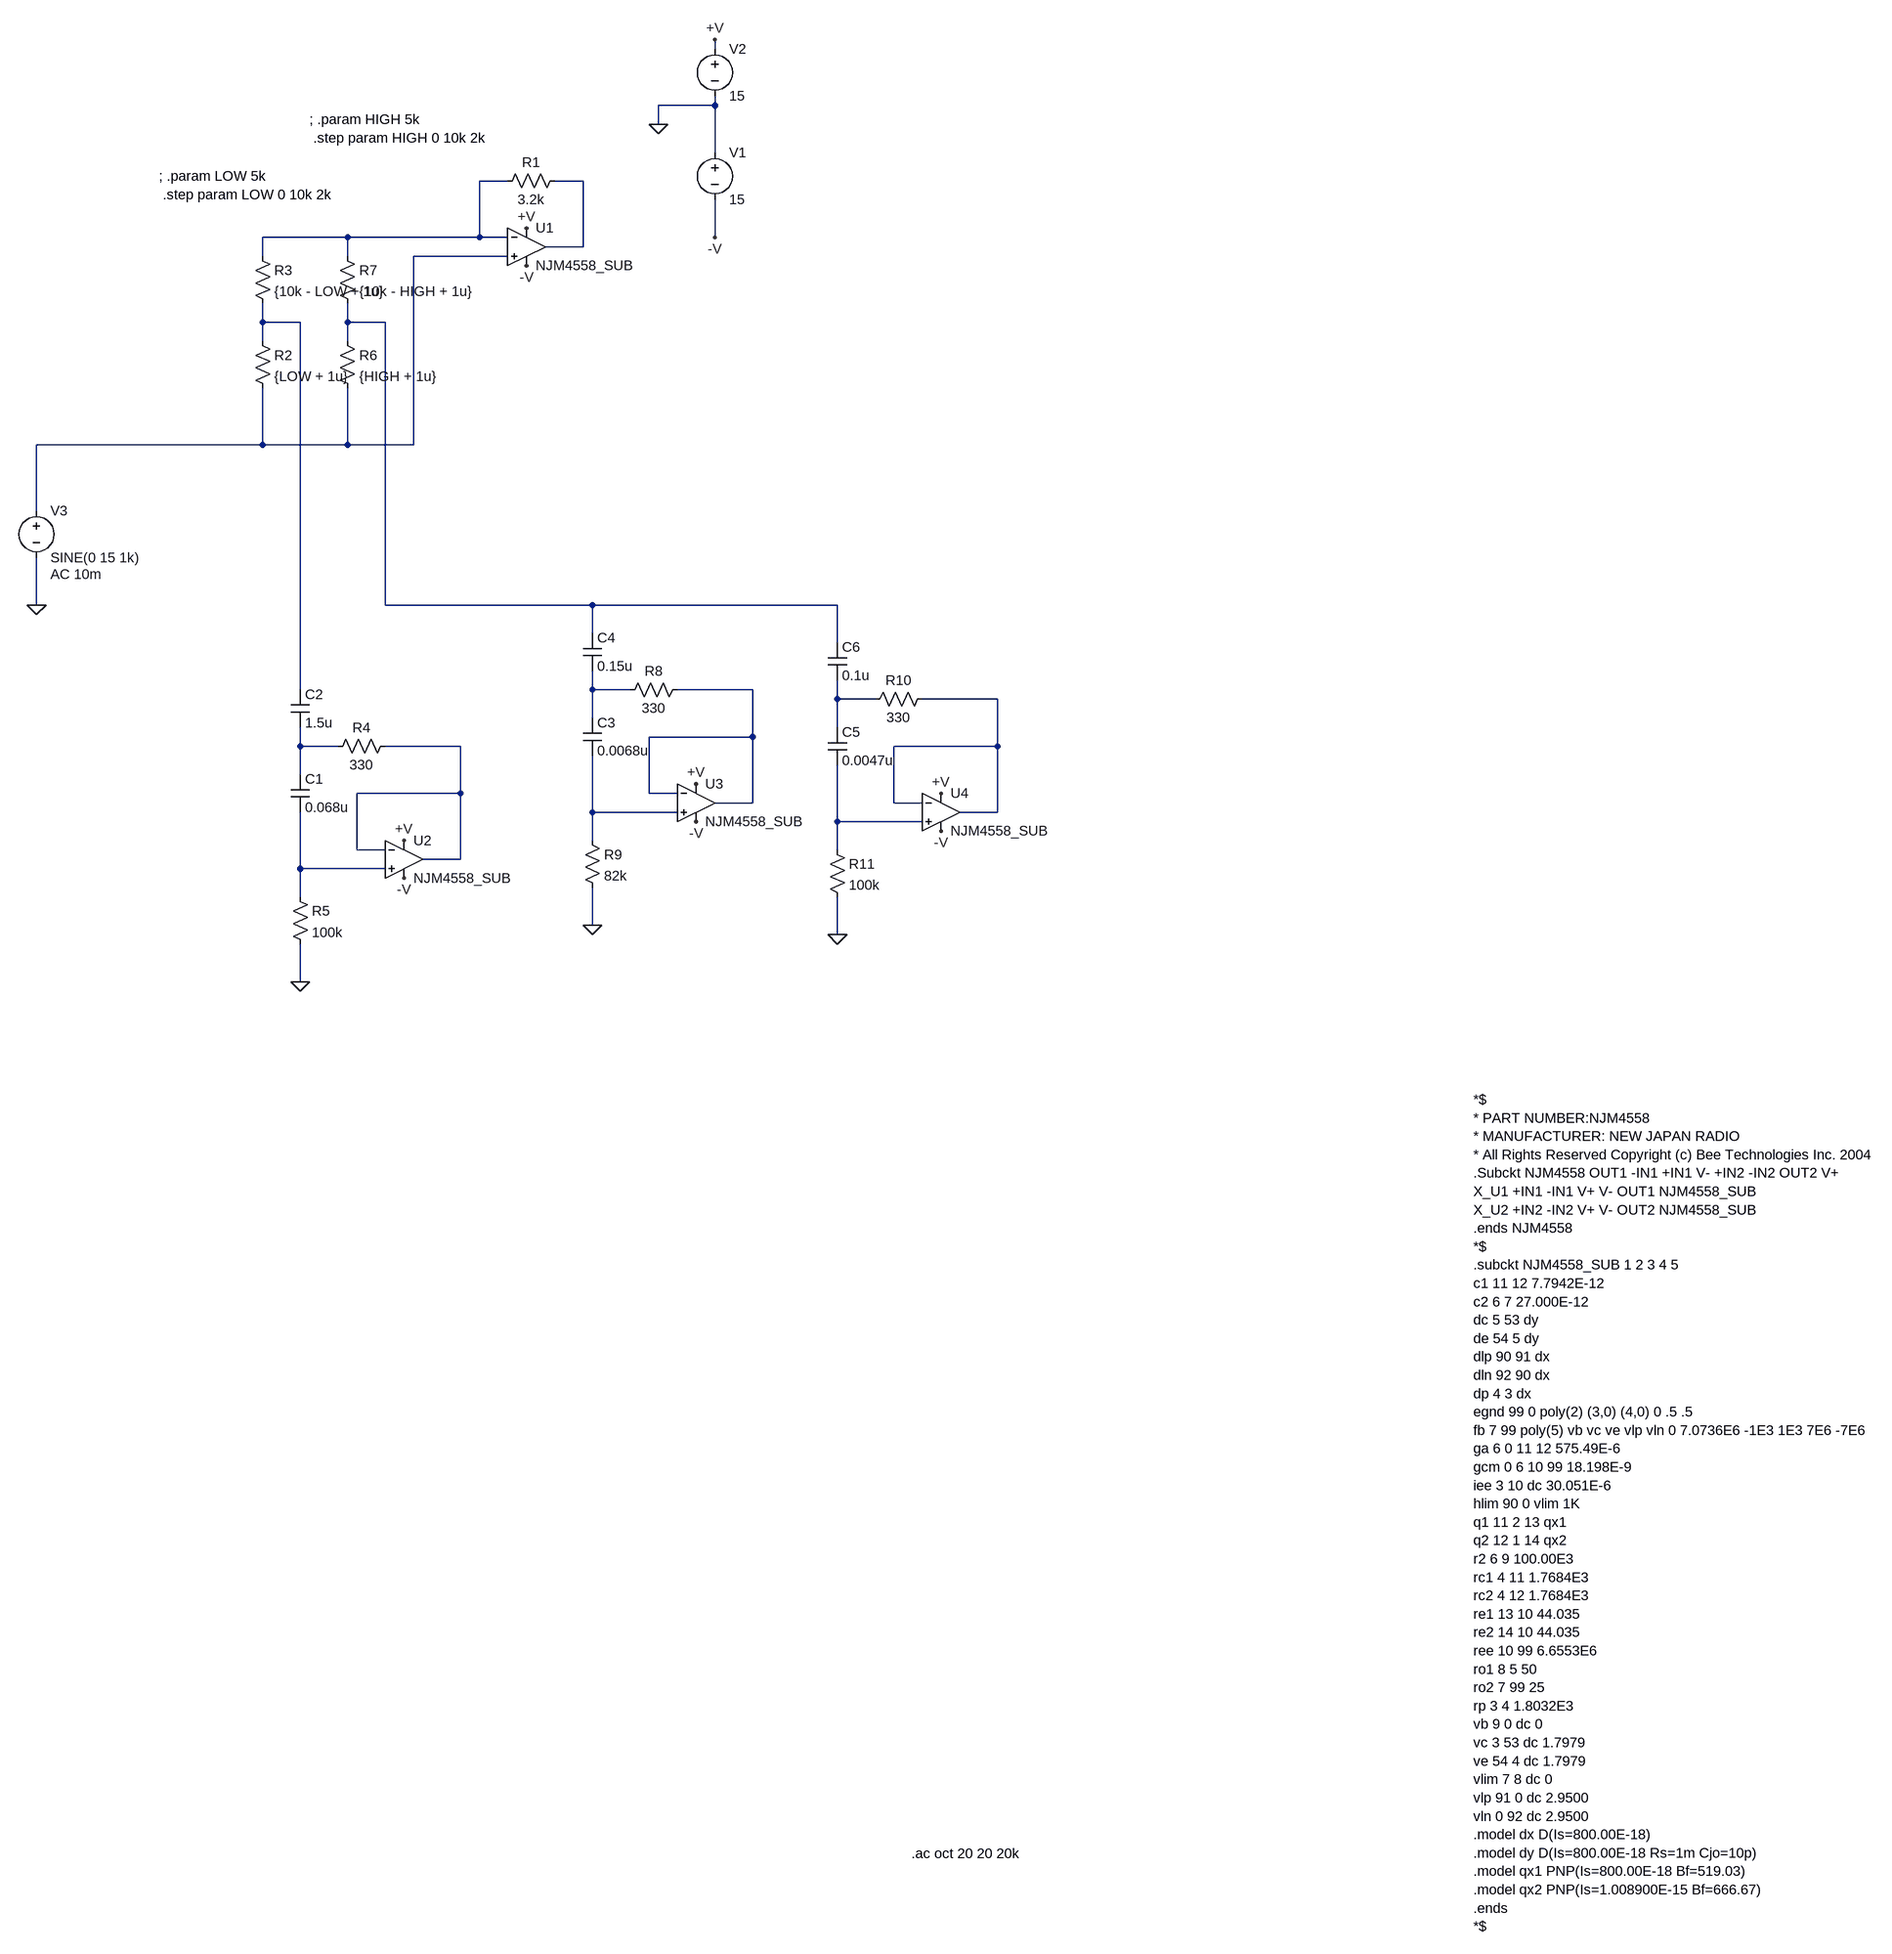
[diagram p0: schematic HM-2_tone.asc]
HM-2_tone.asc, the LTspice schematic file:
Version 4
SHEET 1 1024 2584
WIRE -1168 -496 -1168 -512
WIRE -1168 -400 -1168 -416
WIRE -1168 -400 -1264 -400
WIRE -1264 -368 -1264 -400
WIRE -1168 -320 -1168 -400
WIRE -1520 -272 -1568 -272
WIRE -1392 -272 -1440 -272
WIRE -1792 -176 -1936 -176
WIRE -1568 -176 -1568 -272
WIRE -1568 -176 -1792 -176
WIRE -1520 -176 -1568 -176
WIRE -1168 -176 -1168 -240
WIRE -1392 -160 -1392 -272
WIRE -1392 -160 -1456 -160
WIRE -1936 -144 -1936 -176
WIRE -1792 -144 -1792 -176
WIRE -1520 -144 -1680 -144
WIRE -1936 -32 -1936 -64
WIRE -1872 -32 -1936 -32
WIRE -1792 -32 -1792 -64
WIRE -1728 -32 -1792 -32
WIRE -1936 0 -1936 -32
WIRE -1792 0 -1792 -32
WIRE -1936 176 -1936 80
WIRE -1936 176 -2320 176
WIRE -1792 176 -1792 80
WIRE -1792 176 -1936 176
WIRE -1680 176 -1680 -144
WIRE -1680 176 -1792 176
WIRE -2320 288 -2320 176
WIRE -2320 448 -2320 368
WIRE -1728 448 -1728 -32
WIRE -1376 448 -1728 448
WIRE -960 448 -1376 448
WIRE -1376 496 -1376 448
WIRE -960 512 -960 448
WIRE -1872 592 -1872 -32
WIRE -1376 592 -1376 560
WIRE -1312 592 -1376 592
WIRE -1104 592 -1232 592
WIRE -960 608 -960 576
WIRE -896 608 -960 608
WIRE -688 608 -816 608
WIRE -1376 640 -1376 592
WIRE -960 656 -960 608
WIRE -1104 672 -1104 592
WIRE -1104 672 -1280 672
WIRE -1872 688 -1872 656
WIRE -1808 688 -1872 688
WIRE -1600 688 -1728 688
WIRE -688 688 -688 608
WIRE -688 688 -864 688
WIRE -1872 736 -1872 688
WIRE -1600 768 -1600 688
WIRE -1600 768 -1776 768
WIRE -1280 768 -1280 672
WIRE -1232 768 -1280 768
WIRE -1104 784 -1104 672
WIRE -1104 784 -1168 784
WIRE -864 784 -864 688
WIRE -816 784 -864 784
WIRE -1376 800 -1376 704
WIRE -1232 800 -1376 800
WIRE -688 800 -688 688
WIRE -688 800 -752 800
WIRE -960 816 -960 720
WIRE -816 816 -960 816
WIRE -1376 848 -1376 800
WIRE -1776 864 -1776 768
WIRE -1728 864 -1776 864
WIRE -960 864 -960 816
WIRE -1600 880 -1600 768
WIRE -1600 880 -1664 880
WIRE -1872 896 -1872 800
WIRE -1728 896 -1872 896
WIRE -1872 944 -1872 896
WIRE -1376 992 -1376 928
WIRE -960 1008 -960 944
WIRE -1872 1088 -1872 1024
FLAG -2320 448 0
FLAG -1264 -368 0
FLAG -1168 -512 +V
FLAG -1488 -192 +V
FLAG -1488 -128 -V
FLAG -1168 -176 -V
FLAG -1696 848 +V
FLAG -1696 912 -V
FLAG -1872 1088 0
FLAG -1200 752 +V
FLAG -1200 816 -V
FLAG -1376 992 0
FLAG -784 768 +V
FLAG -784 832 -V
FLAG -960 1008 0
SYMBOL Opamps\\opamp2 -1488 -224 R0
SYMATTR InstName U1
SYMATTR Value NJM4558_SUB
SYMBOL voltage -1168 -336 R0
WINDOW 123 0 0 Left 2
WINDOW 39 0 0 Left 2
SYMATTR InstName V1
SYMATTR Value 15
SYMBOL voltage -1168 -512 R0
WINDOW 123 0 0 Left 2
WINDOW 39 0 0 Left 2
SYMATTR InstName V2
SYMATTR Value 15
SYMBOL voltage -2320 272 R0
WINDOW 123 24 124 Left 2
WINDOW 39 0 0 Left 2
SYMATTR Value2 AC 10m
SYMATTR InstName V3
SYMATTR Value SINE(0 15 1k)
SYMBOL res -1424 -288 R90
WINDOW 0 0 56 VBottom 2
WINDOW 3 32 56 VTop 2
SYMATTR InstName R1
SYMATTR Value 3.2k
SYMBOL res -1952 -16 R0
SYMATTR InstName R2
SYMATTR Value {LOW + 1u}
SYMBOL Opamps\\opamp2 -1696 816 R0
SYMATTR InstName U2
SYMATTR Value NJM4558_SUB
SYMBOL cap -1888 736 R0
SYMATTR InstName C1
SYMATTR Value 0.068u
SYMBOL cap -1888 592 R0
SYMATTR InstName C2
SYMATTR Value 1.5u
SYMBOL res -1712 672 R90
WINDOW 0 0 56 VBottom 2
WINDOW 3 32 56 VTop 2
SYMATTR InstName R4
SYMATTR Value 330
SYMBOL res -1888 928 R0
SYMATTR InstName R5
SYMATTR Value 100k
SYMBOL res -1952 -160 R0
SYMATTR InstName R3
SYMATTR Value {10k - LOW + 1u}
SYMBOL res -1808 -16 R0
SYMATTR InstName R6
SYMATTR Value {HIGH + 1u}
SYMBOL res -1808 -160 R0
SYMATTR InstName R7
SYMATTR Value {10k - HIGH + 1u}
SYMBOL Opamps\\opamp2 -1200 720 R0
SYMATTR InstName U3
SYMATTR Value NJM4558_SUB
SYMBOL cap -1392 640 R0
SYMATTR InstName C3
SYMATTR Value 0.0068u
SYMBOL cap -1392 496 R0
SYMATTR InstName C4
SYMATTR Value 0.15u
SYMBOL res -1216 576 R90
WINDOW 0 0 56 VBottom 2
WINDOW 3 32 56 VTop 2
SYMATTR InstName R8
SYMATTR Value 330
SYMBOL res -1392 832 R0
SYMATTR InstName R9
SYMATTR Value 82k
SYMBOL Opamps\\opamp2 -784 736 R0
SYMATTR InstName U4
SYMATTR Value NJM4558_SUB
SYMBOL cap -976 656 R0
SYMATTR InstName C5
SYMATTR Value 0.0047u
SYMBOL cap -976 512 R0
SYMATTR InstName C6
SYMATTR Value 0.1u
SYMBOL res -800 592 R90
WINDOW 0 0 56 VBottom 2
WINDOW 3 32 56 VTop 2
SYMATTR InstName R10
SYMATTR Value 330
SYMBOL res -976 848 R0
SYMATTR InstName R11
SYMATTR Value 100k
TEXT 120 1288 Left 2 !*$\n* PART NUMBER:NJM4558\n* MANUFACTURER: NEW JAPAN RADIO\n* All Rights Reserved Copyright (c) Bee Technologies Inc. 2004\n.Subckt NJM4558 OUT1 -IN1 +IN1 V- +IN2 -IN2 OUT2 V+\nX_U1 +IN1 -IN1 V+ V- OUT1 NJM4558_SUB\nX_U2 +IN2 -IN2 V+ V- OUT2 NJM4558_SUB\n.ends NJM4558\n*$\n.subckt NJM4558_SUB 1 2 3 4 5\nc1 11 12 7.7942E-12\nc2 6 7 27.000E-12\ndc 5 53 dy\nde 54 5 dy\ndlp 90 91 dx\ndln 92 90 dx\ndp 4 3 dx\negnd 99 0 poly(2) (3,0) (4,0) 0 .5 .5\nfb 7 99 poly(5) vb vc ve vlp vln 0 7.0736E6 -1E3 1E3 7E6 -7E6\nga 6 0 11 12 575.49E-6\ngcm 0 6 10 99 18.198E-9\niee 3 10 dc 30.051E-6\nhlim 90 0 vlim 1K\nq1 11 2 13 qx1\nq2 12 1 14 qx2\nr2 6 9 100.00E3\nrc1 4 11 1.7684E3\nrc2 4 12 1.7684E3\nre1 13 10 44.035\nre2 14 10 44.035\nree 10 99 6.6553E6\nro1 8 5 50\nro2 7 99 25\nrp 3 4 1.8032E3\nvb 9 0 dc 0\nvc 3 53 dc 1.7979\nve 54 4 dc 1.7979\nvlim 7 8 dc 0\nvlp 91 0 dc 2.9500\nvln 0 92 dc 2.9500\n.model dx D(Is=800.00E-18)\n.model dy D(Is=800.00E-18 Rs=1m Cjo=10p)\n.model qx1 PNP(Is=800.00E-18 Bf=519.03)\n.model qx2 PNP(Is=1.008900E-15 Bf=666.67)\n.ends\n*$
TEXT -834 2568 Left 2 !.ac oct 20 20 20k
TEXT -2112 -280 Left 2 !; .param LOW 5k\n .step param LOW 0 10k 2k
TEXT -1856 -376 Left 2 !; .param HIGH 5k\n .step param HIGH 0 10k 2k

The netlist it stands for:
* HM-2_tone.asc
XU1 N003 N001 +V -V N002 NJM4558_SUB  ; pins In+ In- V+ V- OUT
V1 0 -V 15
V2 +V 0 15
V3 N003 0 SINE(0 15 1k) AC 10m
R1 N002 N001 3.2k
R2 N004 N003 {LOW + 1u}
XU2 N014 N011 +V -V N011 NJM4558_SUB  ; pins In+ In- V+ V- OUT
C1 N010 N014 0.068u
C2 N004 N010 1.5u
R4 N011 N010 330
R5 N014 0 100k
R3 N001 N004 {10k - LOW + 1u}
R6 N005 N003 {HIGH + 1u}
R7 N001 N005 {10k - HIGH + 1u}
XU3 N012 N007 +V -V N007 NJM4558_SUB  ; pins In+ In- V+ V- OUT
C3 N006 N012 0.0068u
C4 N005 N006 0.15u
R8 N007 N006 330
R9 N012 0 82k
XU4 N013 N009 +V -V N009 NJM4558_SUB  ; pins In+ In- V+ V- OUT
C5 N008 N013 0.0047u
C6 N005 N008 0.1u
R10 N009 N008 330
R11 N013 0 100k
*$
* PART NUMBER:NJM4558
* MANUFACTURER: NEW JAPAN RADIO
* All Rights Reserved Copyright (c) Bee Technologies Inc. 2004
.Subckt NJM4558 OUT1 -IN1 +IN1 V- +IN2 -IN2 OUT2 V+
X_U1 +IN1 -IN1 V+ V- OUT1 NJM4558_SUB
X_U2 +IN2 -IN2 V+ V- OUT2 NJM4558_SUB
.ends NJM4558
*$
.subckt NJM4558_SUB 1 2 3 4 5
c1 11 12 7.7942E-12
c2 6 7 27.000E-12
dc 5 53 dy
de 54 5 dy
dlp 90 91 dx
dln 92 90 dx
dp 4 3 dx
egnd 99 0 poly(2) (3,0) (4,0) 0 .5 .5
fb 7 99 poly(5) vb vc ve vlp vln 0 7.0736E6 -1E3 1E3 7E6 -7E6
ga 6 0 11 12 575.49E-6
gcm 0 6 10 99 18.198E-9
iee 3 10 dc 30.051E-6
hlim 90 0 vlim 1K
q1 11 2 13 qx1
q2 12 1 14 qx2
r2 6 9 100.00E3
rc1 4 11 1.7684E3
rc2 4 12 1.7684E3
re1 13 10 44.035
re2 14 10 44.035
ree 10 99 6.6553E6
ro1 8 5 50
ro2 7 99 25
rp 3 4 1.8032E3
vb 9 0 dc 0
vc 3 53 dc 1.7979
ve 54 4 dc 1.7979
vlim 7 8 dc 0
vlp 91 0 dc 2.9500
vln 0 92 dc 2.9500
.model dx D(Is=800.00E-18)
.model dy D(Is=800.00E-18 Rs=1m Cjo=10p)
.model qx1 PNP(Is=800.00E-18 Bf=519.03)
.model qx2 PNP(Is=1.008900E-15 Bf=666.67)
.ends
*$
.ac oct 20 20 20k
; .param LOW 5k
 .step param LOW 0 10k 2k
; .param HIGH 5k
 .step param HIGH 0 10k 2k
.backanno
.end